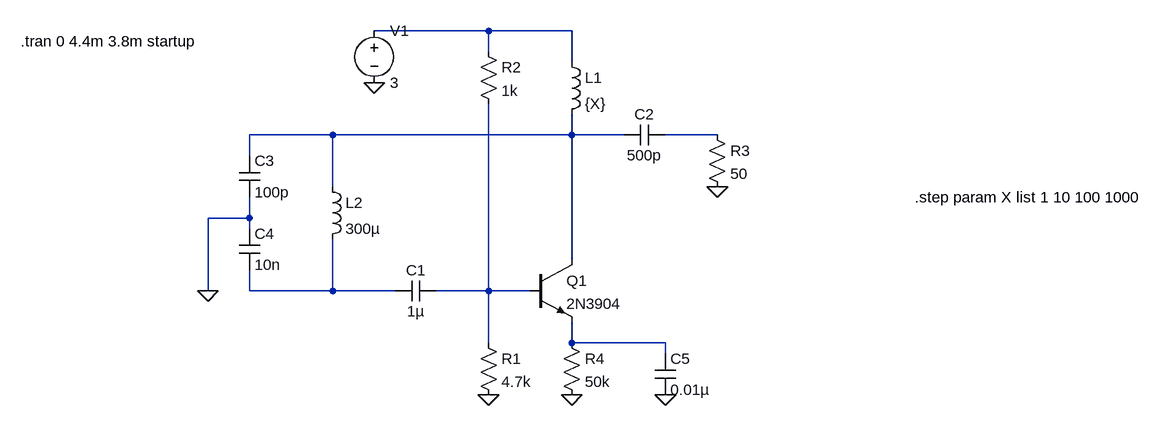
[diagram p0: schematic colpitts_220MHz_2.asc]
colpitts_220MHz_2.asc, the LTspice schematic file:
Version 4
SHEET 1 1452 680
WIRE 112 -224 -64 -224
WIRE 240 -224 112 -224
WIRE 112 -192 112 -224
WIRE 240 -176 240 -224
WIRE -128 -64 -256 -64
WIRE 240 -64 240 -96
WIRE 240 -64 -128 -64
WIRE 320 -64 240 -64
WIRE 464 -64 384 -64
WIRE -256 -32 -256 -64
WIRE -128 16 -128 -64
WIRE -256 64 -256 32
WIRE -256 64 -320 64
WIRE -256 80 -256 64
WIRE 240 128 240 -64
WIRE -320 176 -320 64
WIRE -256 176 -256 144
WIRE -128 176 -128 96
WIRE -128 176 -256 176
WIRE -32 176 -128 176
WIRE 112 176 112 -112
WIRE 112 176 32 176
WIRE 176 176 112 176
WIRE 112 256 112 176
WIRE 240 256 240 224
WIRE 384 256 240 256
WIRE 384 272 384 256
FLAG 112 336 0
FLAG -320 176 0
FLAG 464 16 0
FLAG -64 -144 0
FLAG 240 336 0
FLAG 384 336 0
SYMBOL res 96 240 R0
SYMATTR InstName R1
SYMATTR Value 4.7k
SYMBOL res 96 -208 R0
SYMATTR InstName R2
SYMATTR Value 1k
SYMBOL npn 176 128 R0
SYMATTR InstName Q1
SYMATTR Value 2N3904
SYMBOL cap 32 160 R90
WINDOW 0 0 32 VBottom 2
WINDOW 3 32 32 VTop 2
SYMATTR InstName C1
SYMATTR Value 1µ
SYMBOL ind 224 -192 R0
SYMATTR InstName L1
SYMATTR Value {X}
SYMBOL cap 384 -80 R90
WINDOW 0 0 32 VBottom 2
WINDOW 3 32 32 VTop 2
SYMATTR InstName C2
SYMATTR Value 500p
SYMBOL ind -144 0 R0
SYMATTR InstName L2
SYMATTR Value 300µ
SYMBOL cap -272 -32 R0
SYMATTR InstName C3
SYMATTR Value 100p
SYMBOL cap -272 80 R0
SYMATTR InstName C4
SYMATTR Value 10n
SYMBOL res 448 -80 R0
SYMATTR InstName R3
SYMATTR Value 50
SYMBOL voltage -64 -240 R0
SYMATTR InstName V1
SYMATTR Value 3
SYMBOL res 224 240 R0
SYMATTR InstName R4
SYMATTR Value 50k
SYMBOL cap 368 272 R0
SYMATTR InstName C5
SYMATTR Value 0.01µ
TEXT -608 -208 Left 2 !.tran 0 4.4m 3.8m startup
TEXT 768 32 Left 2 !.step param X list 1 10 100 1000

The netlist it stands for:
* colpitts_220MHz_2.asc
R1 N005 0 4.7k
R2 N001 N005 1k
Q1 N002 N005 N006 0 2N3904
C1 N005 N004 1µ
L1 N001 N002 {X}
C2 N003 N002 500p
L2 N002 N004 300µ
C3 N002 0 100p
C4 0 N004 10n
R3 N003 0 50
V1 N001 0 3
R4 N006 0 50k
C5 N006 0 0.01µ
.model NPN NPN
.model PNP PNP
.lib standard.bjt
.tran 0 4.4m 3.8m startup
.step param X list 1 10 100 1000
.backanno
.end